# EAGLE schematic maximus (EAGLE 9.6.2)
Assembly variants: basic

## Sheet 1 of 3: Input connector, power
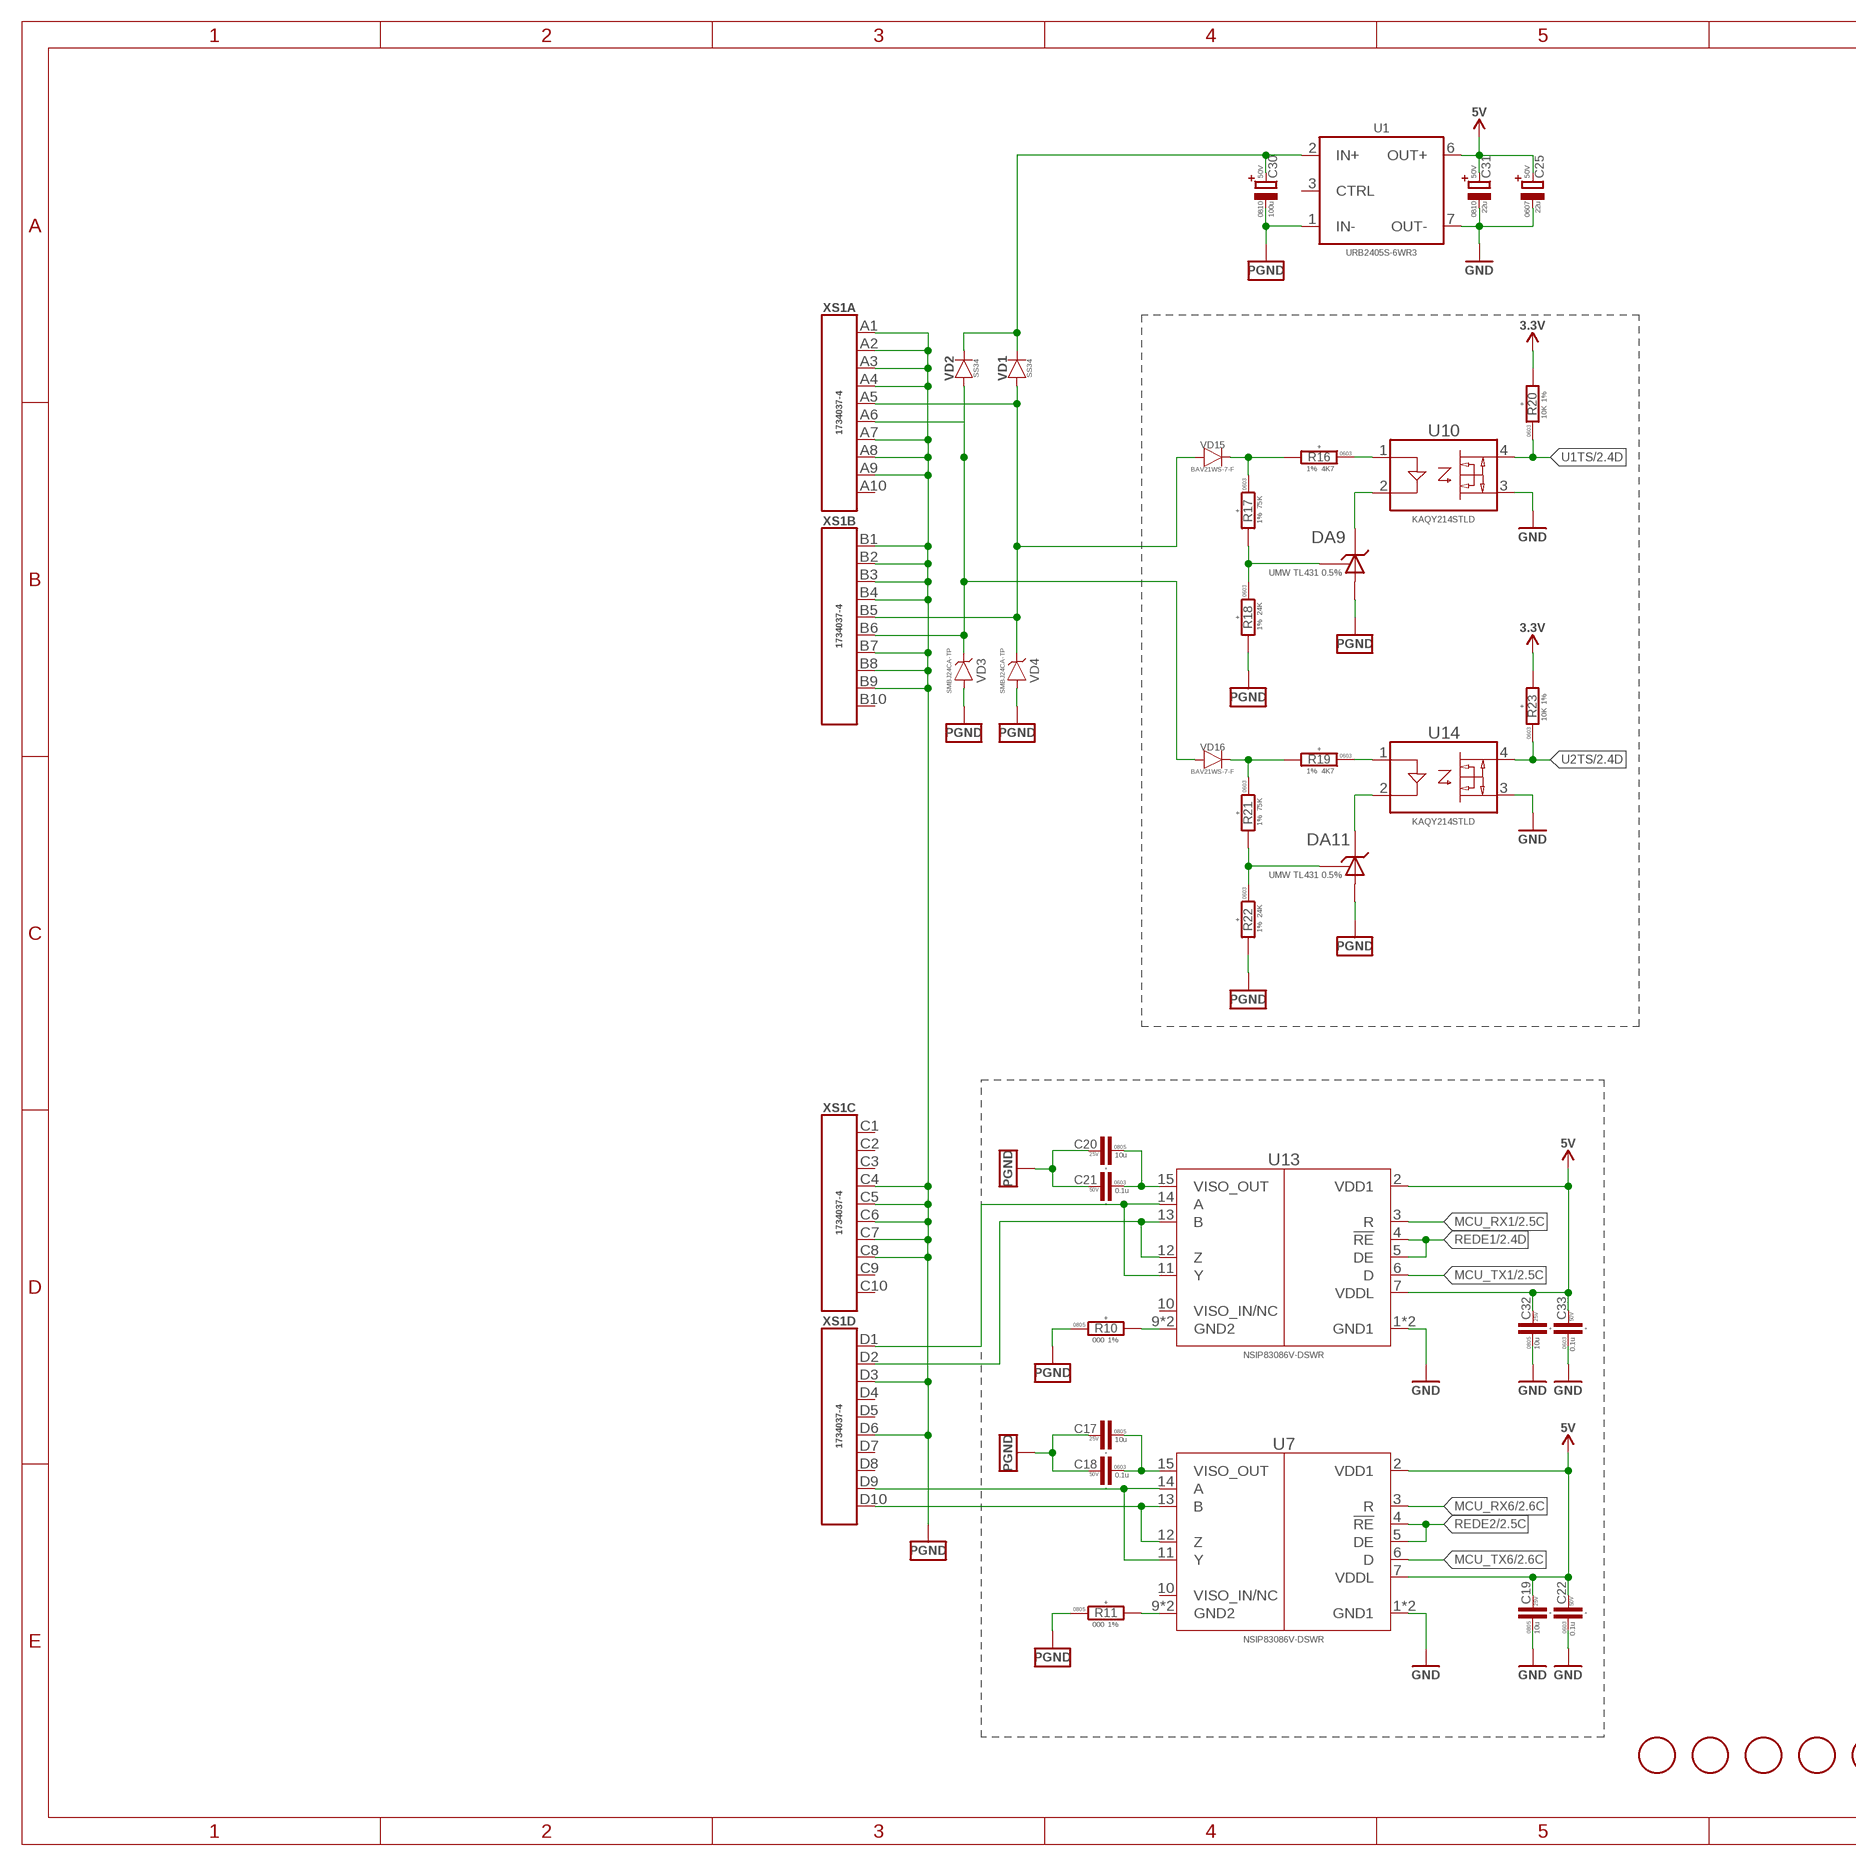
[diagram p0: schematic, sheet 1, part 1 of 2]
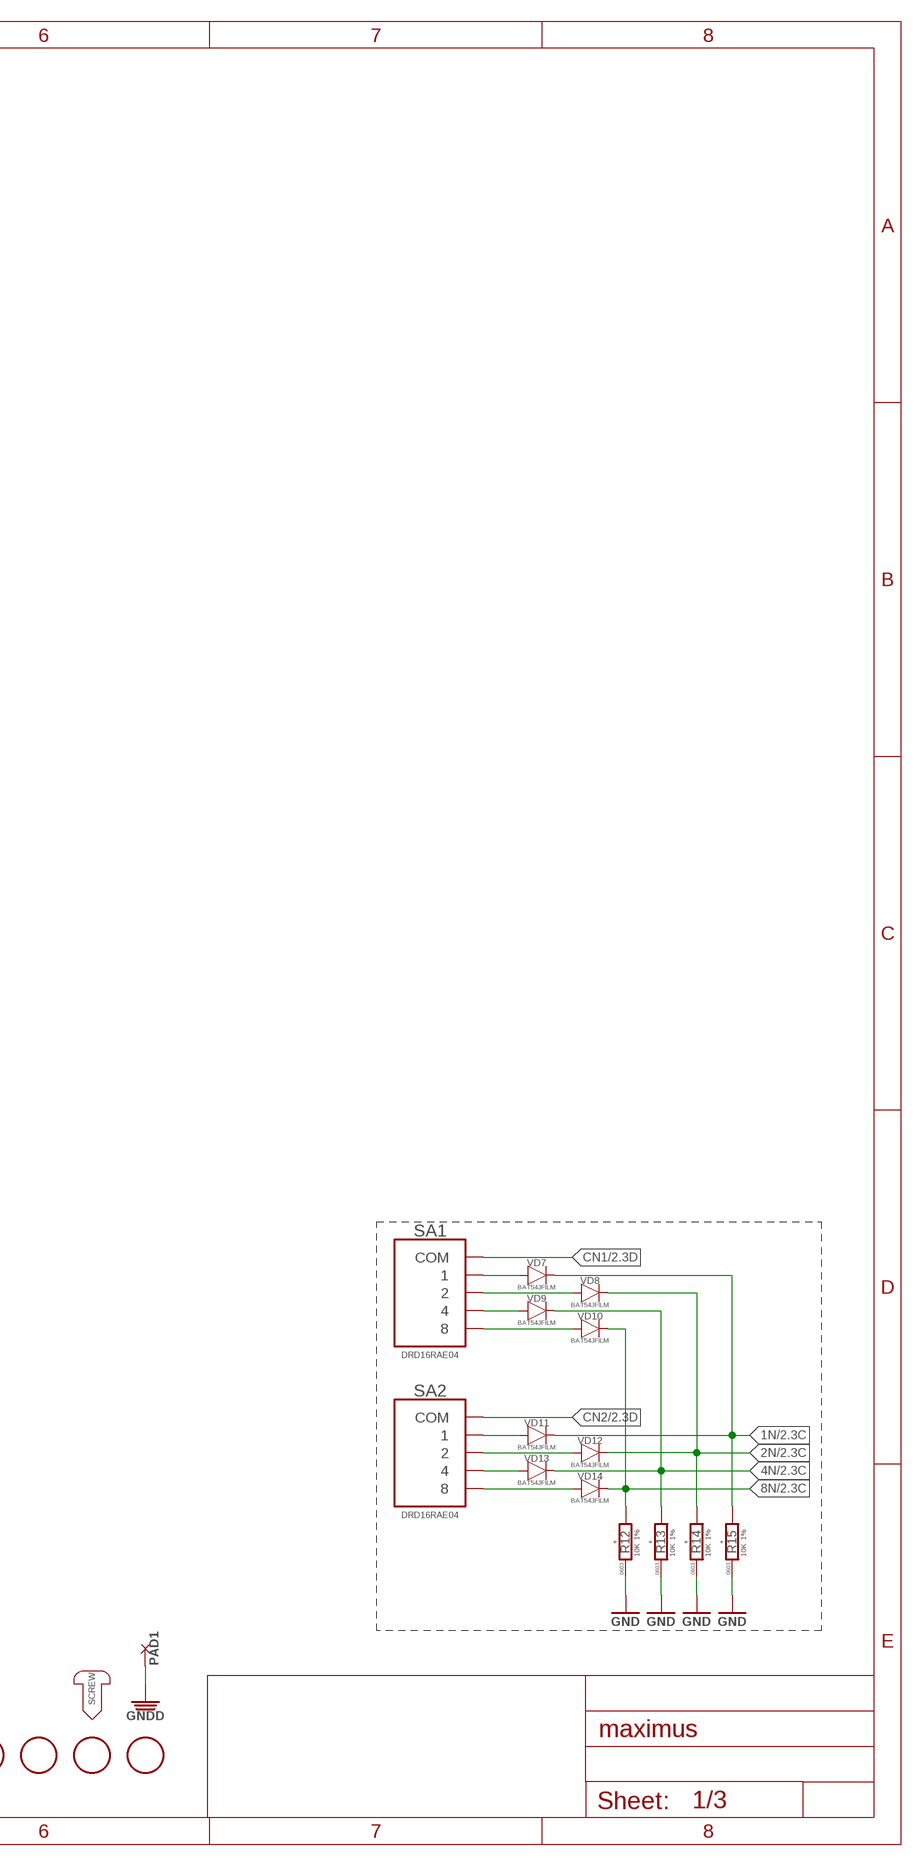
[diagram p1: schematic, sheet 1, part 2 of 2]

### Parts
C17  10u  C-0805  [C0805]
C18  0.1u  C-0603  [C0603]
C19  10u  C-0805  [C0805]
C20  10u  C-0805  [C0805]
C21  0.1u  C-0603  [C0603]
C22  0.1u  C-0603  [C0603]
C25  22u  CPOL-SMD_6.3X7.7  [CAP_SMD_6.3X7.7]
C30  100u  CPOL-SMD-8X10  [SMD-0810]
C31  22u  CPOL-SMD-8X10  [SMD-0810]  (not fitted in variant basic)
C32  10u  C-0805  [C0805]
C33  0.1u  C-0603  [C0603]
DA9  TL431  [SOT23-3]
DA11  TL431  [SOT23-3]
FD1  FIDUCIALMOUNT  [FIDUCIAL_MOUNT]  (not fitted in variant basic)
FD2  FIDUCIALMOUNT  [FIDUCIAL_MOUNT]  (not fitted in variant basic)
FD3  FIDUCIALMOUNT  [FIDUCIAL_MOUNT]  (not fitted in variant basic)
FD4  FIDUCIALMOUNT  [FIDUCIAL_MOUNT]  (not fitted in variant basic)
FD5  FIDUCIALMOUNT  [FIDUCIAL_MOUNT]  (not fitted in variant basic)
FD6  FIDUCIALMOUNT  [FIDUCIAL_MOUNT]  (not fitted in variant basic)
FD7  FIDUCIALMOUNT  [FIDUCIAL_MOUNT]  (not fitted in variant basic)
PAD1  PAD-8.3X3  [8.3X3]  (not fitted in variant basic)
R10  000  R-1%-0805  [R0805]
R11  000  R-1%-0805  [R0805]
R12  10K  R-1%-0603  [R0603]
R13  10K  R-1%-0603  [R0603]
R14  10K  R-1%-0603  [R0603]
R15  10K  R-1%-0603  [R0603]
R16  4K7  R-1%-0603  [R0603]
R17  75K  R-1%-0603  [R0603]
R18  24K  R-1%-0603  [R0603]
R19  4K7  R-1%-0603  [R0603]
R20  10K  R-1%-0603  [R0603]
R21  75K  R-1%-0603  [R0603]
R22  24K  R-1%-0603  [R0603]
R23  10K  R-1%-0603  [R0603]
SA1  DRD16RAE04  [DRD16RAE04]
SA2  DRD16RAE04  [DRD16RAE04]
SCR1  SCREW-M3-D3.1  [PCB_SCREW_M3-D3.1]  (not fitted in variant basic)
U1  URB2405S-6WR3  [URB_S-6WR3]
U7  NSIP83086(V)  [SOIC16-300MIL]
U10  KAQY214-SOP-4  [SOP-4]
U13  NSIP83086(V)  [SOIC16-300MIL]
U14  KAQY214-SOP-4  [SOP-4]
VD1  SS34  [DO-214AC(SMA)]
VD2  SS34  [DO-214AC(SMA)]
VD3  SMBJ24CA-SMB  [DO-214AA(SMB)]
VD4  SMBJ24CA-SMB  [DO-214AA(SMB)]
VD7  BAT54JFILM  [SOD323]
VD8  BAT54JFILM  [SOD323]
VD9  BAT54JFILM  [SOD323]
VD10  BAT54JFILM  [SOD323]
VD11  BAT54JFILM  [SOD323]
VD12  BAT54JFILM  [SOD323]
VD13  BAT54JFILM  [SOD323]
VD14  BAT54JFILM  [SOD323]
VD15  BAV21WS  [SOD323]
VD16  BAV21WS  [SOD323]
XS1  1734037-4  [1734037-4]

### Nets
1N: R15.2 VD7.C VD11.C ; also sheet 2
2N: R14.2 VD8.C VD12.C ; also sheet 2
4N: R13.2 VD9.C VD13.C ; also sheet 2
8N: R12.2 VD10.C VD14.C ; also sheet 2
CN1: SA1.C_1(COM) SA1.C_2(COM) ; also sheet 2
CN2: SA2.C_1(COM) SA2.C_2(COM) ; also sheet 2
GND: C19.1 C22.1 C25.- C31.- C32.1 C33.1 R12.1 R13.1 R14.1 R15.1 U1.7(OUT-) U7.1(GND1) U7.8(GND1) U10.3(EMITTER) U13.1(GND1) U13.8(GND1) U14.3(EMITTER) ; also sheet 2,3
GNDD: PAD1.P$1 ; also sheet 3
ISO24V: C30.+ U1.2(IN+) VD1.C VD2.C
MCU_RX1: U13.3(R) ; also sheet 2
MCU_RX6: U7.3(R) ; also sheet 2
MCU_TX1: U13.6(D) ; also sheet 2
MCU_TX6: U7.6(D) ; also sheet 2
N$17: DA9.2(C) U10.2(C)
N$18: DA9.1(R) R17.2 R18.1
N$19: R16.1 U10.1(A)
N$20: R16.2 R17.1 VD15.C
N$22: DA11.2(C) U14.2(C)
N$23: DA11.1(R) R21.2 R22.1
N$24: R19.1 U14.1(A)
N$25: R19.2 R21.1 VD16.C
N$43: R11.2 U7.9(GND2) U7.16(GND2)
N$46: C20.1 C21.1 U13.15(VISO_OUT)
N$48: VD1.A VD4.C VD15.A XS1.A5 XS1.B5
N$49: VD2.A VD3.C VD16.A XS1.A6 XS1.B6
N$51: U7.11(Y) U7.14(A) XS1.D9
N$53: U7.12(Z) U7.13(B) XS1.D10
N$69: R10.2 U13.9(GND2) U13.16(GND2)
N$74: U13.11(Y) U13.14(A) XS1.D1
N$75: U13.12(Z) U13.13(B) XS1.D2
N$82: C17.1 C18.1 U7.15(VISO_OUT)
N$84: SA1.1 VD7.A
N$85: SA1.2 VD8.A
N$86: SA1.4 VD9.A
N$90: SA1.8 VD10.A
N$92: SA2.1 VD11.A
N$93: SA2.2 VD12.A
N$94: SA2.4 VD13.A
N$98: SA2.8 VD14.A
PGND: C17.2 C18.2 C20.2 C21.2 C30.- DA9.3(A) DA11.3(A) R10.1 R11.1 R18.2 R22.2 U1.1(IN-) VD3.A VD4.A XS1.A1 XS1.A2 XS1.A3 XS1.A4 XS1.A7 XS1.A8 XS1.A9 XS1.B1 XS1.B2 XS1.B3 XS1.B4 XS1.B7 XS1.B8 XS1.B9 XS1.C4 XS1.C5 XS1.C6 XS1.C7 XS1.C8 XS1.D3 XS1.D6
REDE1: U13.4(!RE) U13.5(DE) ; also sheet 2
REDE2: U7.4(!RE) U7.5(DE) ; also sheet 2
U1TS: R20.1 U10.4(COLLECTOR) ; also sheet 2
U2TS: R23.1 U14.4(COLLECTOR) ; also sheet 2
VDD_3V3: R20.2 R23.2 ; supply symbol labelled 3.3V ; also sheet 2
VDD_5V: C19.2 C22.2 C25.+ C31.+ C32.2 C33.2 U1.6(OUT+) U7.2(VDD1) U7.7(VDDL) U13.2(VDD1) U13.7(VDDL) ; supply symbol labelled 5V ; also sheet 2,3
Unconnected: U1.3(CTRL) U7.10(VISO_IN/NC) U13.10(VISO_IN/NC) XS1.A10 XS1.B10 XS1.C1 XS1.C2 XS1.C3 XS1.C9 XS1.C10 XS1.D4 XS1.D5 XS1.D7 XS1.D8

## Sheet 2 of 3: MCU
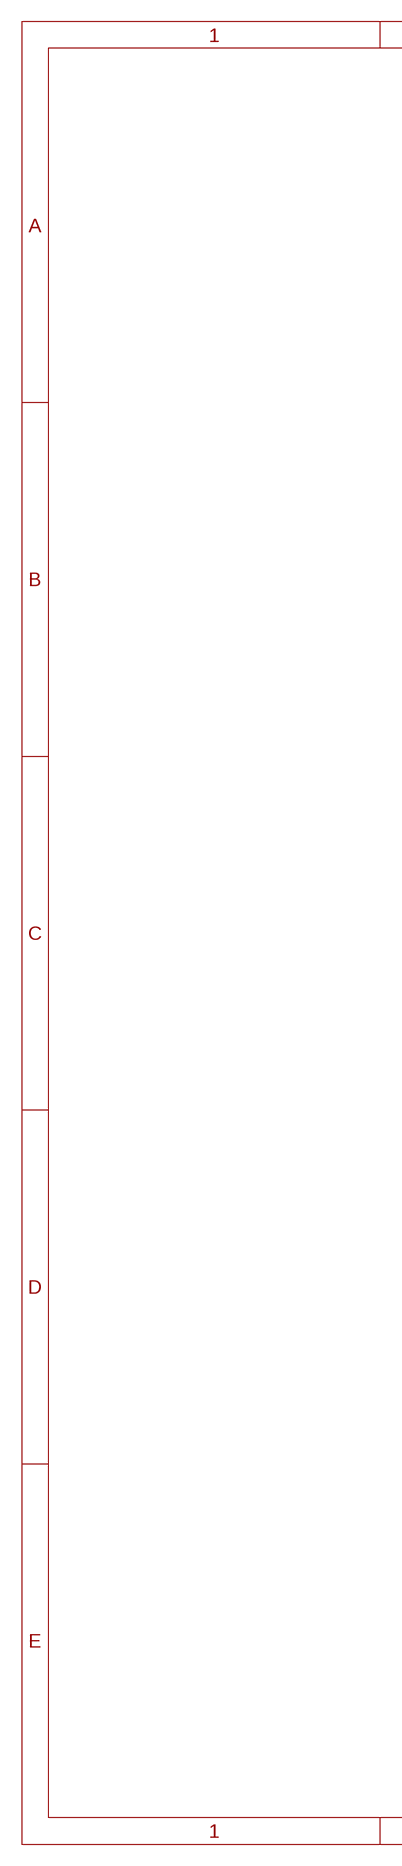
[diagram p2: schematic, sheet 2, part 1 of 2]
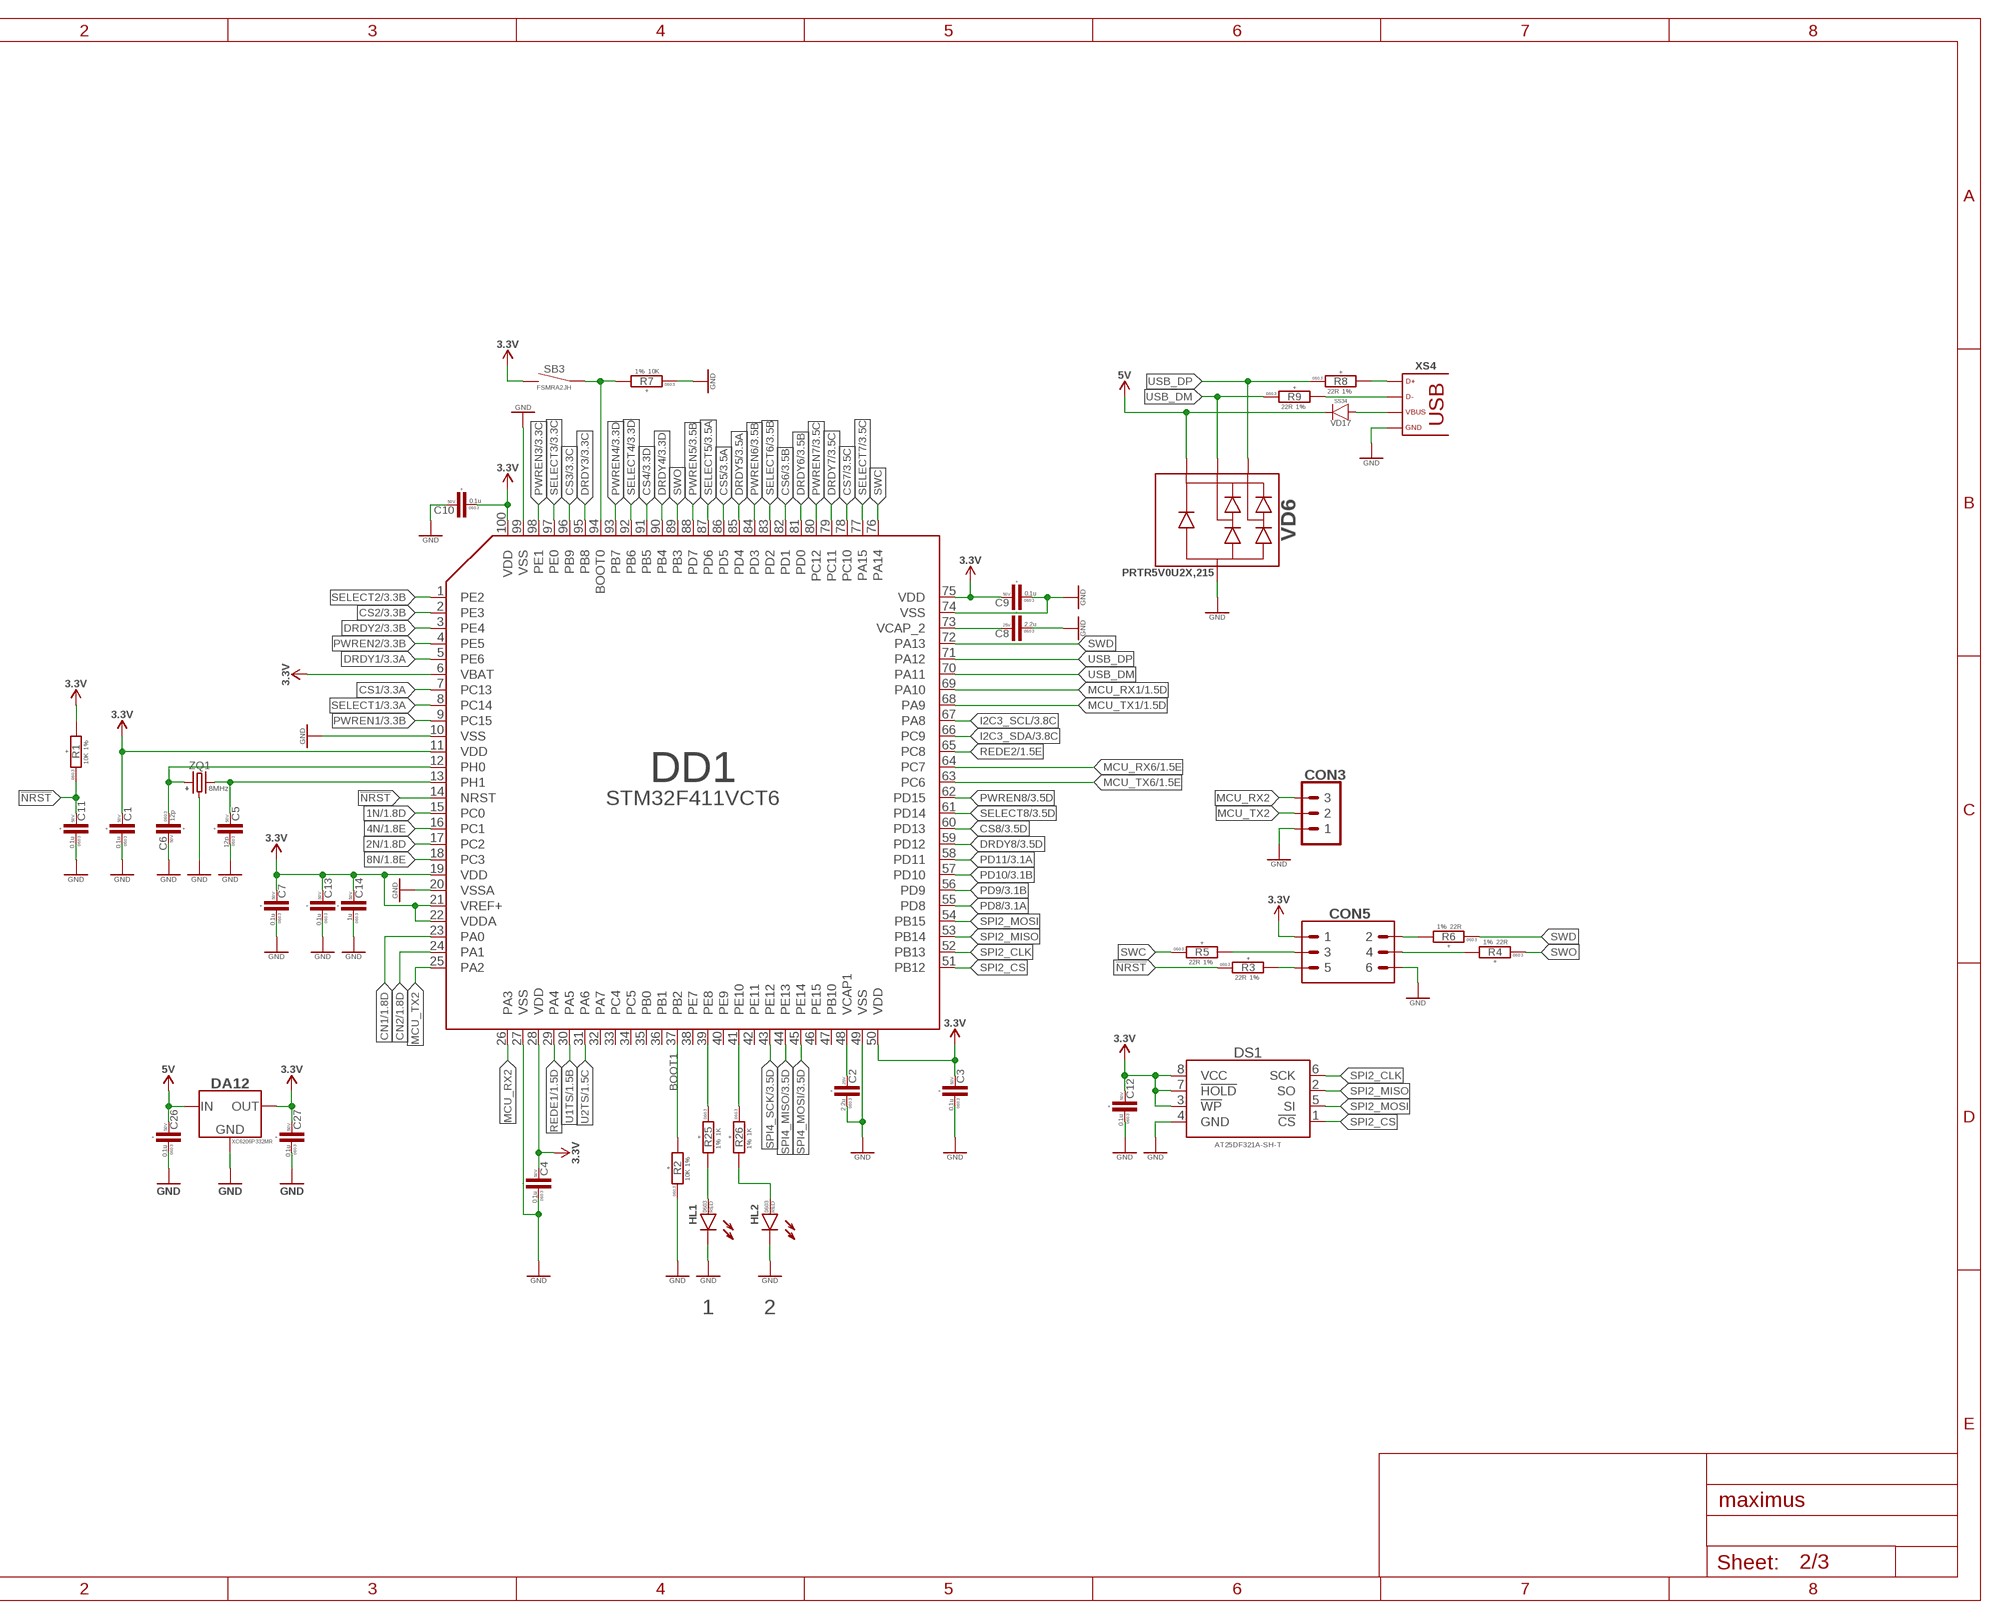
[diagram p3: schematic, sheet 2, part 2 of 2]

### Parts
C1  0.1u  C-0603  [C0603]
C2  2.2u  C-0603  [C0603]
C3  0.1u  C-0603  [C0603]
C4  0.1u  C-0603  [C0603]
C5  12p  C-0603  [C0603]
C6  12p  C-0603  [C0603]
C7  0.1u  C-0603  [C0603]
C8  2.2u  C-0603  [C0603]
C9  0.1u  C-0603  [C0603]
C10  0.1u  C-0603  [C0603]
C11  0.1u  C-0603  [C0603]
C12  0.1u  C-0603  [C0603]
C13  0.1u  C-0603  [C0603]
C14  1u  C-0603  [C0603]
C26  0.1u  C-0603  [C0603]
C27  0.1u  C-0603  [C0603]
CON3  PINHEAD_1X03-2.54  [PLS3]  (not fitted in variant basic)
CON5  PINHEAD_2X03-PTH-2.54  [PLD6]  (not fitted in variant basic)
DA12  XC6206P332  [SOT23-3]
DD1  STM32F411VCT6  [LQFP100]
DS1  AT25DF321A  [SOIC8-208MIL]
HL1  LED-0603  [LED0603]
HL2  LED-0603  [LED0603]
R1  10K  R-1%-0603  [R0603]
R2  10K  R-1%-0603  [R0603]
R3  22R  R-1%-0603  [R0603]
R4  22R  R-1%-0603  [R0603]
R5  22R  R-1%-0603  [R0603]
R6  22R  R-1%-0603  [R0603]
R7  10K  R-1%-0603  [R0603]
R8  22R  R-1%-0603  [R0603]
R9  22R  R-1%-0603  [R0603]
R25  1K  R-1%-0603  [R0603]
R26  1K  R-1%-0603  [R0603]
SB3  TACT_SWITCH-KLS-KLS7-TS6606  [KLS7-TS6606-5.0-180]
VD6  PRTR5V0U2X  [SOT143B]
VD17  SS34  [DO-214AC(SMA)]
XS4  USB-TYPE-B  [USB-B]
ZQ1  8MHz  CRYSTAL-4P-3.2X2.5  [OSCILLATOR-3.2X2.5-4P]

### Nets
1N: DD1.15(PC0) ; also sheet 1
2N: DD1.17(PC2) ; also sheet 1
4N: DD1.16(PC1) ; also sheet 1
8N: DD1.18(PC3) ; also sheet 1
!NRST: C11.2 DD1.14(NRST) R1.1 R3.1
BOOT0: DD1.94(BOOT0) R7.2 SB3.1
BOOT1: DD1.37(PB2) R2.2
CN1: DD1.23(PA0) ; also sheet 1
CN2: DD1.24(PA1) ; also sheet 1
CS1: DD1.7(PC13) ; also sheet 3
CS2: DD1.2(PE3) ; also sheet 3
CS3: DD1.96(PB9) ; also sheet 3
CS4: DD1.91(PB5) ; also sheet 3
CS5: DD1.86(PD5) ; also sheet 3
CS6: DD1.82(PD1) ; also sheet 3
CS7: DD1.78(PC10) ; also sheet 3
CS8: DD1.60(PD13) ; also sheet 3
DRDY1: DD1.5(PE6) ; also sheet 3
DRDY2: DD1.3(PE4) ; also sheet 3
DRDY3: DD1.95(PB8) ; also sheet 3
DRDY4: DD1.90(PB4) ; also sheet 3
DRDY5: DD1.85(PD4) ; also sheet 3
DRDY6: DD1.81(PD0) ; also sheet 3
DRDY7: DD1.79(PC11) ; also sheet 3
DRDY8: DD1.59(PD12) ; also sheet 3
GND: C1.1 C2.1 C3.1 C4.1 C5.1 C6.2 C7.1 C8.1 C9.1 C10.2 C11.1 C12.1 C13.1 C14.1 C26.1 C27.1 CON3.1 CON5.6 DA12.1(GND) DD1.10(VSS) DD1.20(VSSA) DD1.27(VSS) DD1.49(VSS) DD1.74(VSS) DD1.99(VSS) DS1.4(GND) HL1.C HL2.C R2.1 R7.1 VD6.1(C) XS4.4(GND) XS4.5_1(GND) XS4.5_2(GND) ZQ1.2(GND) ZQ1.4(GND) ; also sheet 1,3
I2C3_SCL: DD1.67(PA8) ; also sheet 3
I2C3_SDA: DD1.66(PC9) ; also sheet 3
MCU_RX1: DD1.69(PA10) ; also sheet 1
MCU_RX2: CON3.3 DD1.26(PA3)
MCU_RX6: DD1.64(PC7) ; also sheet 1
MCU_TX1: DD1.68(PA9) ; also sheet 1
MCU_TX2: CON3.2 DD1.25(PA2)
MCU_TX6: DD1.63(PC6) ; also sheet 1
N$1: C2.2 DD1.48(VCAP1)
N$2: C8.2 DD1.73(VCAP_2)
N$3: CON5.5 R3.2
N$4: C6.1 DD1.12(PH0) ZQ1.1
N$5: C5.2 DD1.13(PH1) ZQ1.3
N$6: CON5.4 R4.2
N$7: CON5.3 R5.2
N$8: CON5.2 R6.2
N$21: HL1.A R25.2
N$26: HL2.A R26.2
N$27: DD1.39(PE8) R25.1
N$37: DD1.41(PE10) R26.1
N$70: R9.2 XS4.2(D-)
N$71: R8.2 XS4.3(D+)
N$72: VD17.A XS4.1(VBUS)
PD8: DD1.55(PD8) ; also sheet 3
PD9: DD1.56(PD9) ; also sheet 3
PD10: DD1.57(PD10) ; also sheet 3
PD11: DD1.58(PD11) ; also sheet 3
PWREN1: DD1.9(PC15) ; also sheet 3
PWREN2: DD1.4(PE5) ; also sheet 3
PWREN3: DD1.98(PE1) ; also sheet 3
PWREN4: DD1.93(PB7) ; also sheet 3
PWREN5: DD1.88(PD7) ; also sheet 3
PWREN6: DD1.84(PD3) ; also sheet 3
PWREN7: DD1.80(PC12) ; also sheet 3
PWREN8: DD1.62(PD15) ; also sheet 3
REDE1: DD1.29(PA4) ; also sheet 1
REDE2: DD1.65(PC8) ; also sheet 1
SELECT1: DD1.8(PC14) ; also sheet 3
SELECT2: DD1.1(PE2) ; also sheet 3
SELECT3: DD1.97(PE0) ; also sheet 3
SELECT4: DD1.92(PB6) ; also sheet 3
SELECT5: DD1.87(PD6) ; also sheet 3
SELECT6: DD1.83(PD2) ; also sheet 3
SELECT7: DD1.77(PA15) ; also sheet 3
SELECT8: DD1.61(PD14) ; also sheet 3
SPI2_CLK: DD1.52(PB13) DS1.6(SCK)
SPI2_CS: DD1.51(PB12) DS1.1(!CS)
SPI2_MISO: DD1.53(PB14) DS1.2(SO)
SPI2_MOSI: DD1.54(PB15) DS1.5(SI)
SPI4_MISO: DD1.44(PE13) ; also sheet 3
SPI4_MOSI: DD1.45(PE14) ; also sheet 3
SPI4_SCK: DD1.43(PE12) ; also sheet 3
SWC: DD1.76(PA14) R5.1
SWD: DD1.72(PA13) R6.1
SWO: DD1.89(PB3) R4.1
U1TS: DD1.30(PA5) ; also sheet 1
U2TS: DD1.31(PA6) ; also sheet 1
USB_DM: DD1.70(PA11) R9.1 VD6.3(D2)
USB_DP: DD1.71(PA12) R8.1 VD6.2(D1)
VDD_3V3: C1.2 C3.2 C4.2 C7.2 C9.2 C10.1 C12.2 C13.2 C14.2 C27.2 CON5.1 DA12.2(OUT) DD1.6(VBAT) DD1.11(VDD) DD1.19(VDD) DD1.21(VREF+) DD1.22(VDDA) DD1.28(VDD) DD1.50(VDD) DD1.75(VDD) DD1.100(VDD) DS1.3(!WP) DS1.7(!HOLD) DS1.8(VCC) R1.2 SB3.2 ; supply symbol labelled 3.3V ; also sheet 1
VDD_5V: C26.2 DA12.3(IN) VD6.4(A) VD17.C ; supply symbol labelled 5V ; also sheet 1,3
Unconnected: DD1.32(PA7) DD1.33(PC4) DD1.34(PC5) DD1.35(PB0) DD1.36(PB1) DD1.38(PE7) DD1.40(PE9) DD1.42(PE11) DD1.46(PE15) DD1.47(PB10)

### Notes on the sheet
- 1 | 2

## Sheet 3 of 3: Measuring part and main connector
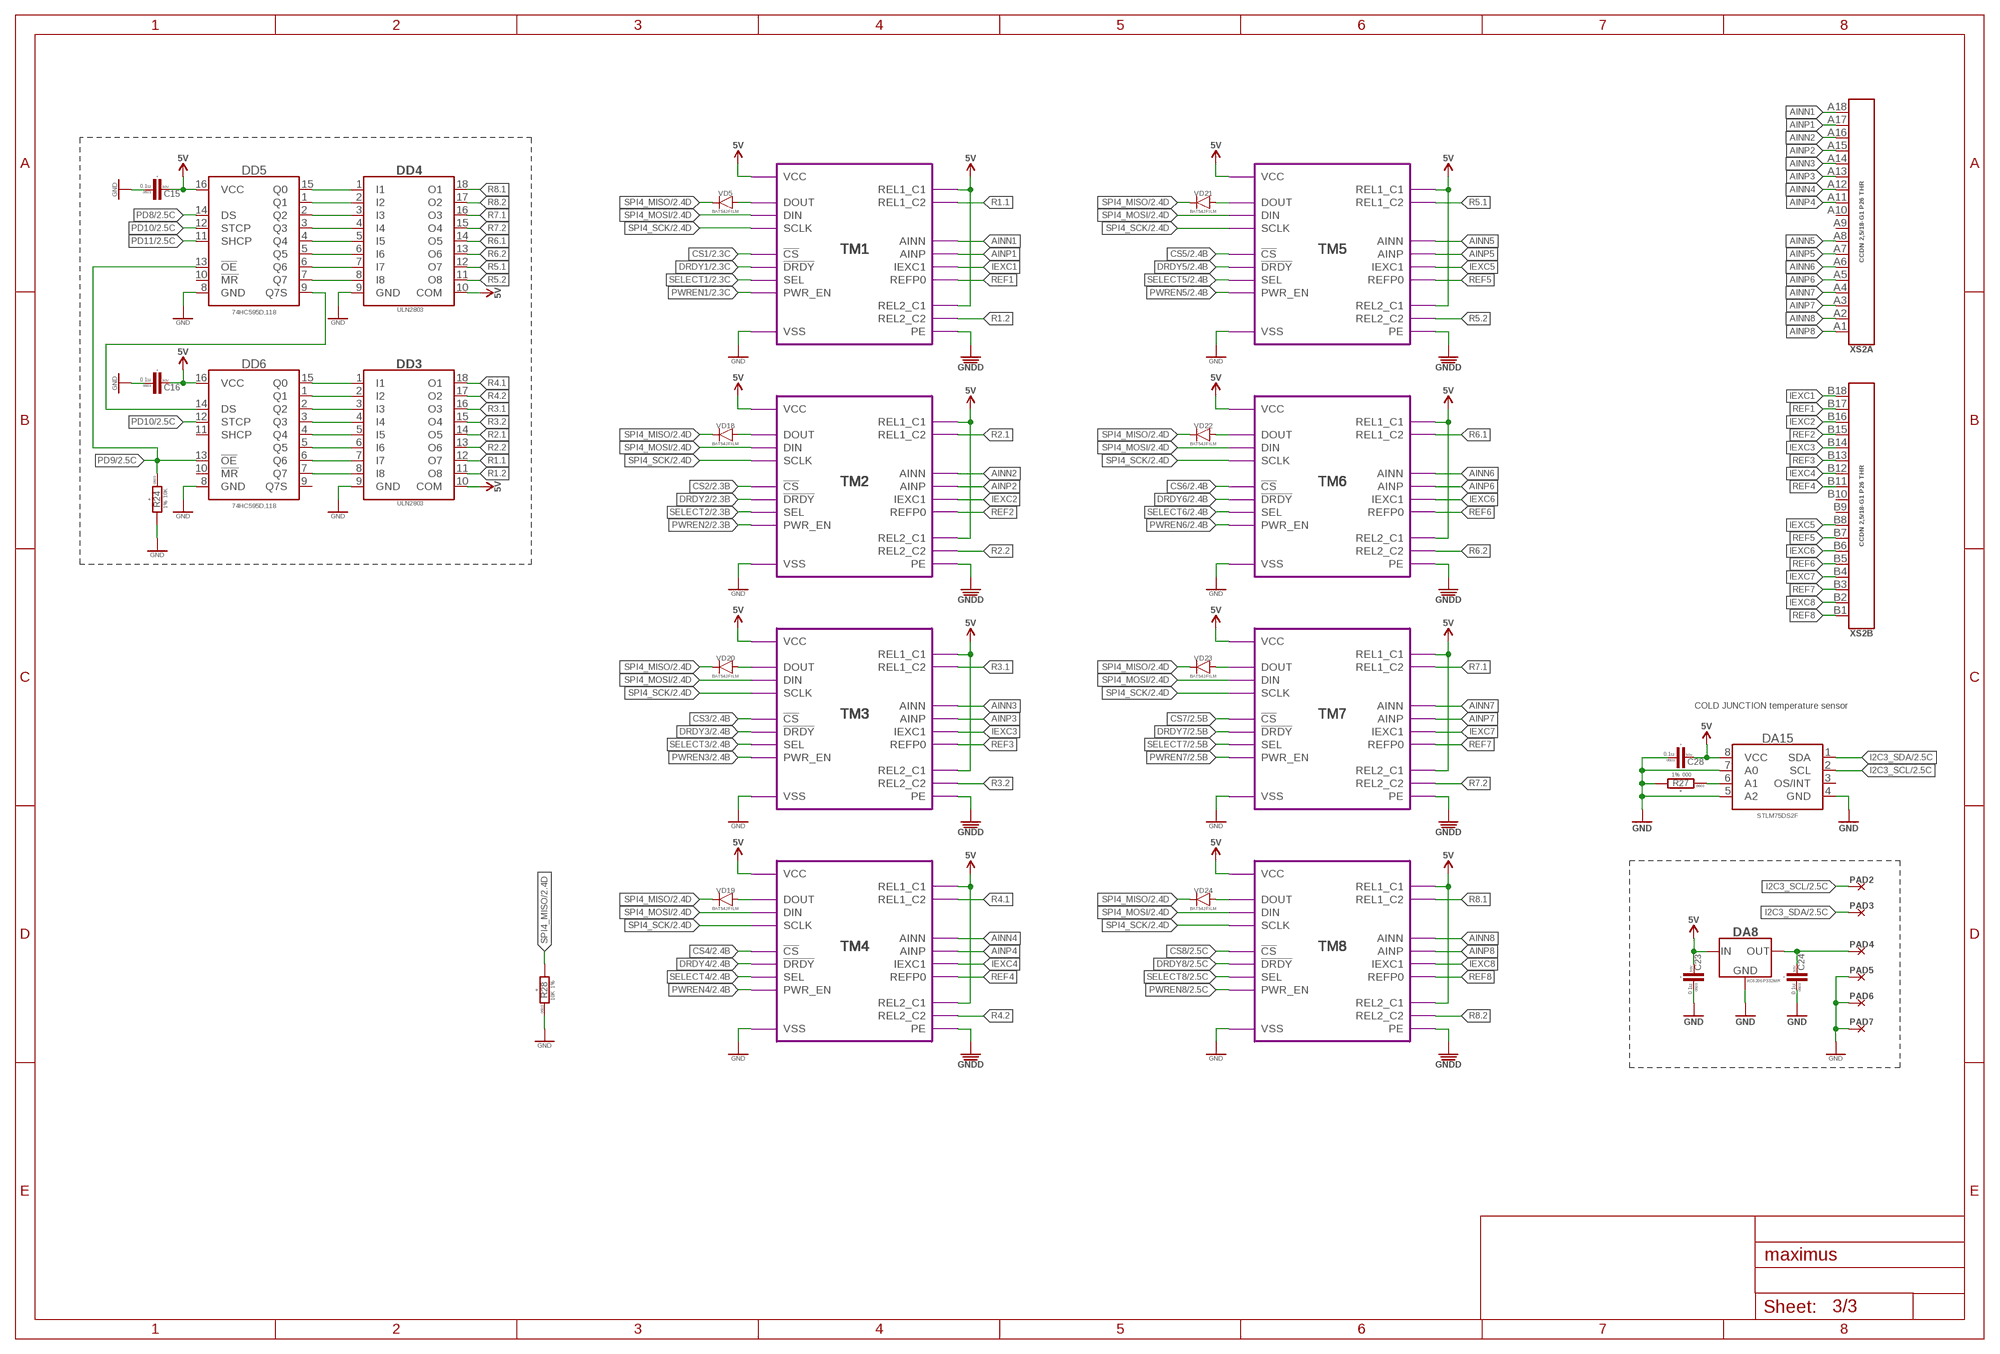
[diagram p4: schematic, sheet 3]

### Parts
C15  0.1u  C-0603  [C0603]
C16  0.1u  C-0603  [C0603]
C23  0.1u  C-0603  [C0603]
C24  0.1u  C-0603  [C0603]
C28  0.1u  C-0603  [C0603]
DA8  XC6206P332  [SOT23-3]
DA15  STLM75  [MSOP8]
DD3  ULN2803  [SOIC18-300MIL]
DD4  ULN2803  [SOIC18-300MIL]
DD5  74HC595  [SOIC16]
DD6  74HC595  [SOIC16]
PAD2  PAD-5X3  [5X3]  (not fitted in variant basic)
PAD3  PAD-5X3  [5X3]  (not fitted in variant basic)
PAD4  PAD-5X3  [5X3]  (not fitted in variant basic)
PAD5  PAD-5X3  [5X3]  (not fitted in variant basic)
PAD6  PAD-5X3  [5X3]  (not fitted in variant basic)
PAD7  PAD-5X3  [5X3]  (not fitted in variant basic)
R24  10K  R-1%-0603  [R0603]
R27  000  R-1%-0603  [R0603]
R28  10K  R-1%-0603  [R0603]
VD5  BAT54JFILM  [SOD323]
VD18  BAT54JFILM  [SOD323]
VD19  BAT54JFILM  [SOD323]
VD20  BAT54JFILM  [SOD323]
VD21  BAT54JFILM  [SOD323]
VD22  BAT54JFILM  [SOD323]
VD23  BAT54JFILM  [SOD323]
VD24  BAT54JFILM  [SOD323]
XS2  CCDN2,5/18-G1P26THR  [CCDN2.5_18-G1P26THR]

### Module instances
TM1 = TMETER (part numbers offset by 100)
TM2 = TMETER (part numbers offset by 200)
TM3 = TMETER (part numbers offset by 300)
TM4 = TMETER (part numbers offset by 400)
TM5 = TMETER (part numbers offset by 500)
TM6 = TMETER (part numbers offset by 600)
TM7 = TMETER (part numbers offset by 700)
TM8 = TMETER (part numbers offset by 800)

### Nets
AINN1: XS2.A18 ; port TM1.AINN
AINN2: XS2.A16 ; port TM2.AINN
AINN3: XS2.A14 ; port TM3.AINN
AINN4: XS2.A12 ; port TM4.AINN
AINN5: XS2.A8 ; port TM5.AINN
AINN6: XS2.A6 ; port TM6.AINN
AINN7: XS2.A4 ; port TM7.AINN
AINN8: XS2.A2 ; port TM8.AINN
AINP1: XS2.A17 ; port TM1.AINP
AINP2: XS2.A15 ; port TM2.AINP
AINP3: XS2.A13 ; port TM3.AINP
AINP4: XS2.A11 ; port TM4.AINP
AINP5: XS2.A7 ; port TM5.AINP
AINP6: XS2.A5 ; port TM6.AINP
AINP7: XS2.A3 ; port TM7.AINP
AINP8: XS2.A1 ; port TM8.AINP
CS1: port TM1.!CS ; also sheet 2
CS2: port TM2.!CS ; also sheet 2
CS3: port TM3.!CS ; also sheet 2
CS4: port TM4.!CS ; also sheet 2
CS5: port TM5.!CS ; also sheet 2
CS6: port TM6.!CS ; also sheet 2
CS7: port TM7.!CS ; also sheet 2
CS8: port TM8.!CS ; also sheet 2
DRDY1: port TM1.!DRDY ; also sheet 2
DRDY2: port TM2.!DRDY ; also sheet 2
DRDY3: port TM3.!DRDY ; also sheet 2
DRDY4: port TM4.!DRDY ; also sheet 2
DRDY5: port TM5.!DRDY ; also sheet 2
DRDY6: port TM6.!DRDY ; also sheet 2
DRDY7: port TM7.!DRDY ; also sheet 2
DRDY8: port TM8.!DRDY ; also sheet 2
GND: C15.1 C16.1 C23.1 C24.1 C28.1 DA8.1(GND) DA15.4(GND) DA15.5(A2) DA15.7(A0) DD3.9(GND) DD4.9(GND) DD5.8(GND) DD6.8(GND) PAD5.P$1 PAD6.P$1 PAD7.P$1 R24.2 R27.2 R28.1 ; port TM1.VSS TM2.VSS TM3.VSS TM4.VSS TM5.VSS TM6.VSS TM7.VSS TM8.VSS ; also sheet 1,2
GNDD: port TM1.PE TM2.PE TM3.PE TM4.PE TM5.PE TM6.PE TM7.PE TM8.PE ; also sheet 1
I2C3_SCL: DA15.2(SCL) PAD2.P$1 ; also sheet 2
I2C3_SDA: DA15.1(SDA) PAD3.P$1 ; also sheet 2
IEXC1: XS2.B18 ; port TM1.IEXC1
IEXC2: XS2.B16 ; port TM2.IEXC1
IEXC3: XS2.B14 ; port TM3.IEXC1
IEXC4: XS2.B12 ; port TM4.IEXC1
IEXC5: XS2.B8 ; port TM5.IEXC1
IEXC6: XS2.B6 ; port TM6.IEXC1
IEXC7: XS2.B4 ; port TM7.IEXC1
IEXC8: XS2.B2 ; port TM8.IEXC1
N$9: DD4.2(I2) DD5.1(Q1)
N$10: DD4.3(I3) DD5.2(Q2)
N$11: DD4.4(I4) DD5.3(Q3)
N$12: DD4.5(I5) DD5.4(Q4)
N$13: DD4.6(I6) DD5.5(Q5)
N$14: DD4.7(I7) DD5.6(Q6)
N$15: DD4.8(I8) DD5.7(Q7)
N$16: DD4.1(I1) DD5.15(Q0)
N$28: DD3.2(I2) DD6.1(Q1)
N$29: DD3.3(I3) DD6.2(Q2)
N$30: DD3.4(I4) DD6.3(Q3)
N$31: DD3.5(I5) DD6.4(Q4)
N$32: DD3.6(I6) DD6.5(Q5)
N$33: DD3.7(I7) DD6.6(Q6)
N$34: DD3.8(I8) DD6.7(Q7)
N$35: DD3.1(I1) DD6.15(Q0)
N$36: DD5.9(Q7S) DD6.14(DS)
N$38: DA15.6(A1) R27.1
N$39: VD5.A ; port TM1.DOUT
N$40: VD18.A ; port TM2.DOUT
N$41: VD19.A ; port TM4.DOUT
N$42: VD20.A ; port TM3.DOUT
N$44: VD21.A ; port TM5.DOUT
N$45: VD22.A ; port TM6.DOUT
N$47: C24.2 DA8.2(OUT) PAD4.P$1
N$50: VD23.A ; port TM7.DOUT
N$52: VD24.A ; port TM8.DOUT
PD8: DD5.14(DS) ; also sheet 2
PD9: DD5.13(!OE) DD6.13(!OE) R24.1 ; also sheet 2
PD10: DD5.12(STCP) DD6.12(STCP) ; also sheet 2
PD11: DD5.11(SHCP) ; also sheet 2
PWREN1: port TM1.PWR_EN ; also sheet 2
PWREN2: port TM2.PWR_EN ; also sheet 2
PWREN3: port TM3.PWR_EN ; also sheet 2
PWREN4: port TM4.PWR_EN ; also sheet 2
PWREN5: port TM5.PWR_EN ; also sheet 2
PWREN6: port TM6.PWR_EN ; also sheet 2
PWREN7: port TM7.PWR_EN ; also sheet 2
PWREN8: port TM8.PWR_EN ; also sheet 2
R1.1: DD3.12(O7) ; port TM1.REL1_C2
R1.2: DD3.11(O8) ; port TM1.REL2_C2
R2.1: DD3.14(O5) ; port TM2.REL1_C2
R2.2: DD3.13(O6) ; port TM2.REL2_C2
R3.1: DD3.16(O3) ; port TM3.REL1_C2
R3.2: DD3.15(O4) ; port TM3.REL2_C2
R4.1: DD3.18(O1) ; port TM4.REL1_C2
R4.2: DD3.17(O2) ; port TM4.REL2_C2
R5.1: DD4.12(O7) ; port TM5.REL1_C2
R5.2: DD4.11(O8) ; port TM5.REL2_C2
R6.1: DD4.14(O5) ; port TM6.REL1_C2
R6.2: DD4.13(O6) ; port TM6.REL2_C2
R7.1: DD4.16(O3) ; port TM7.REL1_C2
R7.2: DD4.15(O4) ; port TM7.REL2_C2
R8.1: DD4.18(O1) ; port TM8.REL1_C2
R8.2: DD4.17(O2) ; port TM8.REL2_C2
REF1: XS2.B17 ; port TM1.REFP0
REF2: XS2.B15 ; port TM2.REFP0
REF3: XS2.B13 ; port TM3.REFP0
REF4: XS2.B11 ; port TM4.REFP0
REF5: XS2.B7 ; port TM5.REFP0
REF6: XS2.B5 ; port TM6.REFP0
REF7: XS2.B3 ; port TM7.REFP0
REF8: XS2.B1 ; port TM8.REFP0
SELECT1: port TM1.SEL ; also sheet 2
SELECT2: port TM2.SEL ; also sheet 2
SELECT3: port TM3.SEL ; also sheet 2
SELECT4: port TM4.SEL ; also sheet 2
SELECT5: port TM5.SEL ; also sheet 2
SELECT6: port TM6.SEL ; also sheet 2
SELECT7: port TM7.SEL ; also sheet 2
SELECT8: port TM8.SEL ; also sheet 2
SPI4_MISO: R28.2 VD5.C VD18.C VD19.C VD20.C VD21.C VD22.C VD23.C VD24.C ; also sheet 2
SPI4_MOSI: port TM1.DIN TM2.DIN TM3.DIN TM4.DIN TM5.DIN TM6.DIN TM7.DIN TM8.DIN ; also sheet 2
SPI4_SCK: port TM1.SCLK TM2.SCLK TM3.SCLK TM4.SCLK TM5.SCLK TM6.SCLK TM7.SCLK TM8.SCLK ; also sheet 2
VDD_5V: C15.2 C16.2 C23.2 C28.2 DA8.3(IN) DA15.8(VCC) DD3.10(COM) DD4.10(COM) DD5.16(VCC) DD6.16(VCC) ; port TM1.VCC TM2.VCC TM3.VCC TM4.VCC TM5.VCC TM6.VCC TM7.VCC TM8.VCC TM1.REL2_C1 TM1.REL1_C1 TM2.REL2_C1 TM2.REL1_C1 TM3.REL2_C1 TM3.REL1_C1 TM4.REL2_C1 TM4.REL1_C1 TM5.REL2_C1 TM5.REL1_C1 TM6.REL2_C1 TM6.REL1_C1 TM7.REL2_C1 TM7.REL1_C1 TM8.REL2_C1 TM8.REL1_C1 ; supply symbol labelled 5V ; also sheet 1,2
Unconnected: DA15.3(OS/INT) DD5.10(!MR) DD6.9(Q7S) DD6.10(!MR) DD6.11(SHCP) XS2.A9 XS2.A10 XS2.B9 XS2.B10

### Notes on the sheet
- COLD JUNCTION temperature sensor

## Library data of the parts
C1 C3 C4 C7 C9-C13 C15 C16 C18 C21-C24 C26-C28 C33 = rc:C; ALLOCATED: +; LCSC#: C91183; MANF: YAGEO; MANF#: CC0603JRX7R9BB104; PACKAGE: 0603; RU: Конденсатор керамический SMD 0603; VOLTAGE: 50V
C2 C8 = rc:C; ALLOCATED: +; LCSC#: C77047; MANF: muRata; MANF#: GRM188R61E225KA12D; PACKAGE: 0603; RU: Конденсатор керамический SMD 0603; VOLTAGE: 25V
C5 C6 = rc:C; ALLOCATED: +; LCSC#: C107034; MANF: YAGEO; MANF#: CC0603JRNPO9BN120; PACKAGE: 0603; RU: Конденсатор керамический SMD 0603; VOLTAGE: 50V
C14 = rc:C; ALLOCATED: +; LCSC#: C559769; MANF: YAGEO; MANF#: CC0603KRX7R9BB105; PACKAGE: 0603; RU: Конденсатор керамический SMD 0603; VOLTAGE: 50V
C17 C19 C20 C32 = rc:C; ALLOCATED: +; LCSC#: C89831; MANF: YAGEO; MANF#: CC0805KKX5R8BB106; PACKAGE: 0805; RU: Конденсатор керамический SMD 0805; VOLTAGE: 25V
C25 = rc:CPOL: Polar electrolytic or tantalum capacitor; LCSC#: C72505; MANF: RVT1H220M0605; MANF#: ROQANG; PACKAGE: 0607; RU: Конденсатор; VOLTAGE: 50V
C30 = rc:CPOL: Polar electrolytic or tantalum capacitor; LCSC#: C116241; MANF: Nichicon; MANF#: UUD1H101MNL1GS; PACKAGE: 0810; RU: Конденсатор; VOLTAGE: 50V
C31 = rc:CPOL: Polar electrolytic or tantalum capacitor; LCSC#: C413506; MANF: PANASONIC; MANF#: EEEHD1H220P; PACKAGE: 0810; RU: Конденсатор; VOLTAGE: 50V
CON3 = pinhead:PINHEAD_1X03: pinheader 3P
CON5 = pinhead:PINHEAD_2X03; RU: Вилка штыревая 2.54мм 2x3 прямая
DA8 DA12 = linear regulators:XC6206P: 200mA 680mV@(100mA) Fixed 3.3V~3.3V Positive 1 6V SOT-23-3L Linear Voltage Regulators (LDO) ROHS; JLC_TYPE: BASIC; LCSC#: C5446; MANF: Torex Semicon; MANF#: XC6206P332MR; RU: LDO-стабилизатор напряжения, положительный, фиксированный 3,3 В, ток 200 мА
DA9 DA11 = misc:TL431: Adjustable Precision Shunt Regulator; LCSC#: C963380; MANF: Youtai Semiconductor (UMW); MANF#: UMW TL431 0.5%; RU: Прецизионный регулируемый шунтирующий стабилизатор напряжения
DA15 = misc:STLM75: Digital temperature sensor and thermal watchdog; LCSC#: C283291; MANF: STMicroelectronics; MANF#: STLM75DS2F; RU: Микросхема
DD1 = stm32:STM32F411VCT6: Arm® Cortex®-M4 32b MCU+FPU, 125 DMIPS, 512KB Flash, 128KB RAM, USB OTG FS, 11 TIMs, Datasheet <https://www.lcsc.com/datasheet/C1339312.pdf?spm=wm.sxq.inf.ggs___wm.ssy.bg.0.stp&lcsc_vid=E1QMBFMDFlVWAVZSR1MIUVQAQwBcV1AFEQJaV1wDEwcxVlNRQVJaU1VSRFFbVDsOAxUeFF5JWBYZEEoKFBINSQcJGk4%3D>; LCSC#: C1339312; MANF: STMicroelectronics; MANF#: STM32F411VCT6; RU: Микросхема
DD3 DD4 = misc:ULN2803: SOP-18 Plastic-Encapsulate Transistors ULN2803 DARLINGTON TRANSISTOR (NPN); LCSC#: C2829421; MANF: JSCJ; MANF#: ULN2803; RU: Матрица из восьми транзисторов Дарлингтона
DD5 DD6 = misc:74HC595: IC SHIFT REGISTER 8BIT 16SOIC; DIGIKEY#: 1727-2821-2-ND; LCSC#: C5947; MANF: Nexperia USA Inc; MANF#: 74HC595D,118; RU: 8-и битный сдвиговый регистр с выходным регистром-защелки и тремя состояниями
DS1 = misc:AT25DF321A: 32-Megabit 2.7-volt Minimum SPI Serial Flash Memory Datasheet <https://static.chipdip.ru/lib/314/DOC000314047.pdf>; LCSC#: C6490; MANF: RENESAS; MANF#: AT25DF321A-SH-T; RU: Микросхема
FD1-FD7 = misc:FIDUCIALMOUNT; BOM: EXCLUDE
HL1 HL2 = rc:LED: Light emitting diode; COLOR: RED; LCSC#: C5158814; MANF: Ningbo Foryard Optoelectronics; MANF#: FYLS-0603URC; PACKAGE: 0603; RU: Светодиод SMD 0603
PAD1 = PADS:PAD
PAD2-PAD7 = PADS:PAD; BOM: EXCLUDE
R1 R2 R7 R12-R15 R20 R23 R24 R28 = rc:R; ALLOCATED: +; LCSC#: C98220; MANF: YAGEO; MANF#: RC0603FR-0710KL; PACKAGE: 0603; RU: Резистор SMD 0603; TOLERANCE: 1%
R3-R6 R8 R9 = rc:R; ALLOCATED: +; LCSC#: C108405; MANF: YAGEO; MANF#: RC0603JR-0722RL; PACKAGE: 0603; RU: Резистор SMD 0603; TOLERANCE: 1%
R10 R11 = rc:R; ALLOCATED: +; LCSC#: C100045; MANF: YAGEO; MANF#: RC0805FR-070RL; PACKAGE: 0805; RU: Резистор SMD 0805; TOLERANCE: 1%
R16 R19 = rc:R; ALLOCATED: +; LCSC#: C99782; MANF: YAGEO; MANF#: RC0603FR-074K7L; PACKAGE: 0603; RU: Резистор SMD 0603; TOLERANCE: 1%
R17 R21 = rc:R; ALLOCATED: +; LCSC#: C114636; MANF: YAGEO; MANF#: RC0603FR-0775KL; PACKAGE: 0603; RU: Резистор SMD 0603; TOLERANCE: 1%
R18 R22 = rc:R; ALLOCATED: +; LCSC#: C137760; MANF: YAGEO; MANF#: RC0603FR-0724KL; PACKAGE: 0603; RU: Резистор SMD 0603; TOLERANCE: 1%
R25 R26 = rc:R; ALLOCATED: +; LCSC#: C22548; MANF: YAGEO; MANF#: RC0603FR-071KL; PACKAGE: 0603; RU: Резистор SMD 0603; TOLERANCE: 1%
R27 = rc:R; ALLOCATED: +; LCSC#: C95177; MANF: YAGEO; MANF#: RC0603JR-070RL; PACKAGE: 0603; RU: Резистор SMD 0603; TOLERANCE: 1%
SA1 SA2 = misc:DRD16RAE04: Dip Switch Hexadecimal 16 Position Through Hole, Right Angle Rotary for Tool Actuator 0.4VA 20VAC/DC; LCSC#: C5439367; MANF: TE Connectivity; MANF#: DRD16RAE04; RU: Переключатель DRD16RAE04 угловой на плату
SB3 = mechanical:TACT_SWITCH: tact switch; LCSC#: C7543930; MANF: TE Connectivity; MANF#: FSMRA2JH; RU: Кнопка тактовая, угловая
SCR1 = mechanical:SCREW; LENGTH: 5 mm; STANDARD: ISO7380
U1 = dc-dc:URB2405S-6WR3: 6W isolated DC-DC converter wide input and regulated single output SIP package; LCSC#: URB2405S-6WR3; MANF: MORNSUN; MANF#: URB2405S-6WR3; RU: Изолированный DC-DC преобразователь мощностью 6 Вт
U7 U13 = serial_interfaces:NSIP83086(V): Signal Isolated RS-485 Transceiver with Integrated DC to DC Converter; MANF: NOVOSENSE Microelectronics; MANF#: NSIP83086V-DSWR; RU: Микросхема
U10 U14 = misc:KAQY214: Solid State SPST-NO(1 Form A) SOP-4-2.54mm; LCSC#: C113331; MANF: Cosmo; MANF#: KAQY214STLD; RU: Реле твердотельное
VD1 VD2 VD17 = Diodes:SS34: 40V 3A 550mV @ 3A SMA(DO-214AC) Schottky Barrier Diodes; LCSC#: C8678; MANF: MDD（Microdiode Electronics）; MANF#: SS34; RU: Диод Шоттки
VD3 VD4 = TVS_diodes:SMBJ24CA: TVS DIODE 24V 38.9V DO214AA; DIGIKEY#: SMBJ24CA-TPMSCT-ND; LCSC#: C908853; MANF: Micro Commercial Co; MANF#: SMBJ24CA-TP; RU: двунаправленный SMT TVS диод, 24В, 15.42А, 600Вт
VD5 VD7-VD14 VD18-VD24 = Diodes:BAT54JFILM: Small signal Schottky diode; MANF: STMicroelectronics; MANF#: BAT54JFILM; RU: Диод Шоттки, 0.3А, 40В
VD6 = TVS_diodes:PRTR5V0U2X: DIODES - ESD SOT-143; DIGIKEY#: 568-4140-2-ND; LCSC#: C12333; MANF: NXP USA Inc; MANF#: PRTR5V0U2X,215; RU: Подавители статического заряда 5.5В
VD15 VD16 = Diodes:BAV21WS: Diode Independent 200V 200mA Surface Mount SOD-323; LCSC#: C151350; MANF: DIODES BAV21WS-7-F; MANF#: BAV21WS-7-F; RU: Диод одиночный, 200 В, 200 мА, поверхностный монтаж
XS1 = Connectors:1734037-4: PCB Mount Receptacle, Right Angle, Board-to-Board, 40 Position, 1.27 mm [.05 in] Centerline, Gold Flash, Through Hole - Solder, CHAMP .050 Series I; ALT: L-KLS1-SCSI-10-40FLS; MANF: TE connectivity; MANF#: 1734037-4; RU: Pазъем на плату, выводной монтаж, 40 позиций
XS2 = Connectors:CCDN2,5/18-G1P26THR: CCDN 2,5/18-G1 P26 THR - PCB header Link <https://www.phoenixcontact.com/en-pc/products/printed-circuit-board-connector-ccdn-25-18-g1-p26-thr-1734436>; ALT: WJ2EDGRHB-THR-5.0-2*18Р (36pitch); MANF: Phoenix contact; MANF#: CCDN 2,5/18-G1 P26 THR; RU: Pазъем на плату для выводного монтажа, 36 позиций
XS4 = Connectors:USB: Connector Receptacle USB 2; LCSC#: C189733; MANF: Connfly electronic; MANF#: USBB-1J; RU: USB розетка на плату белая, тип B угловая
ZQ1 = crystal:CRYSTAL-4P: Smd Crystal; ALLOCATED: +; LCSC#: C2682775; LOAD_CAPACITANCE: 12p; MANF: YXC Crystal Oscillators; MANF#: X32258MOB4SI; RU: Кварцевый резонатор в корпусе для поверхностного монтажа 3225

## Module TMETER
Ports: !CS(in) !DRDY(out) DIN(in) DOUT(out) SCLK(in) VCC(pwr) VSS(pwr) PWR_EN(pwr) SEL(in) REL1_C1(nc) REL1_C2(nc) REL2_C1(nc) REL2_C2(nc) PE(nc) AINN(nc) AINP(nc) IEXC1(nc) REFP0(nc)
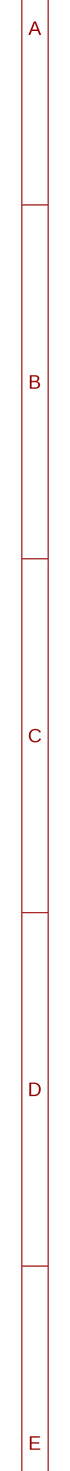
[diagram p5: schematic, module TMETER, sheet 1, part 1 of 2]
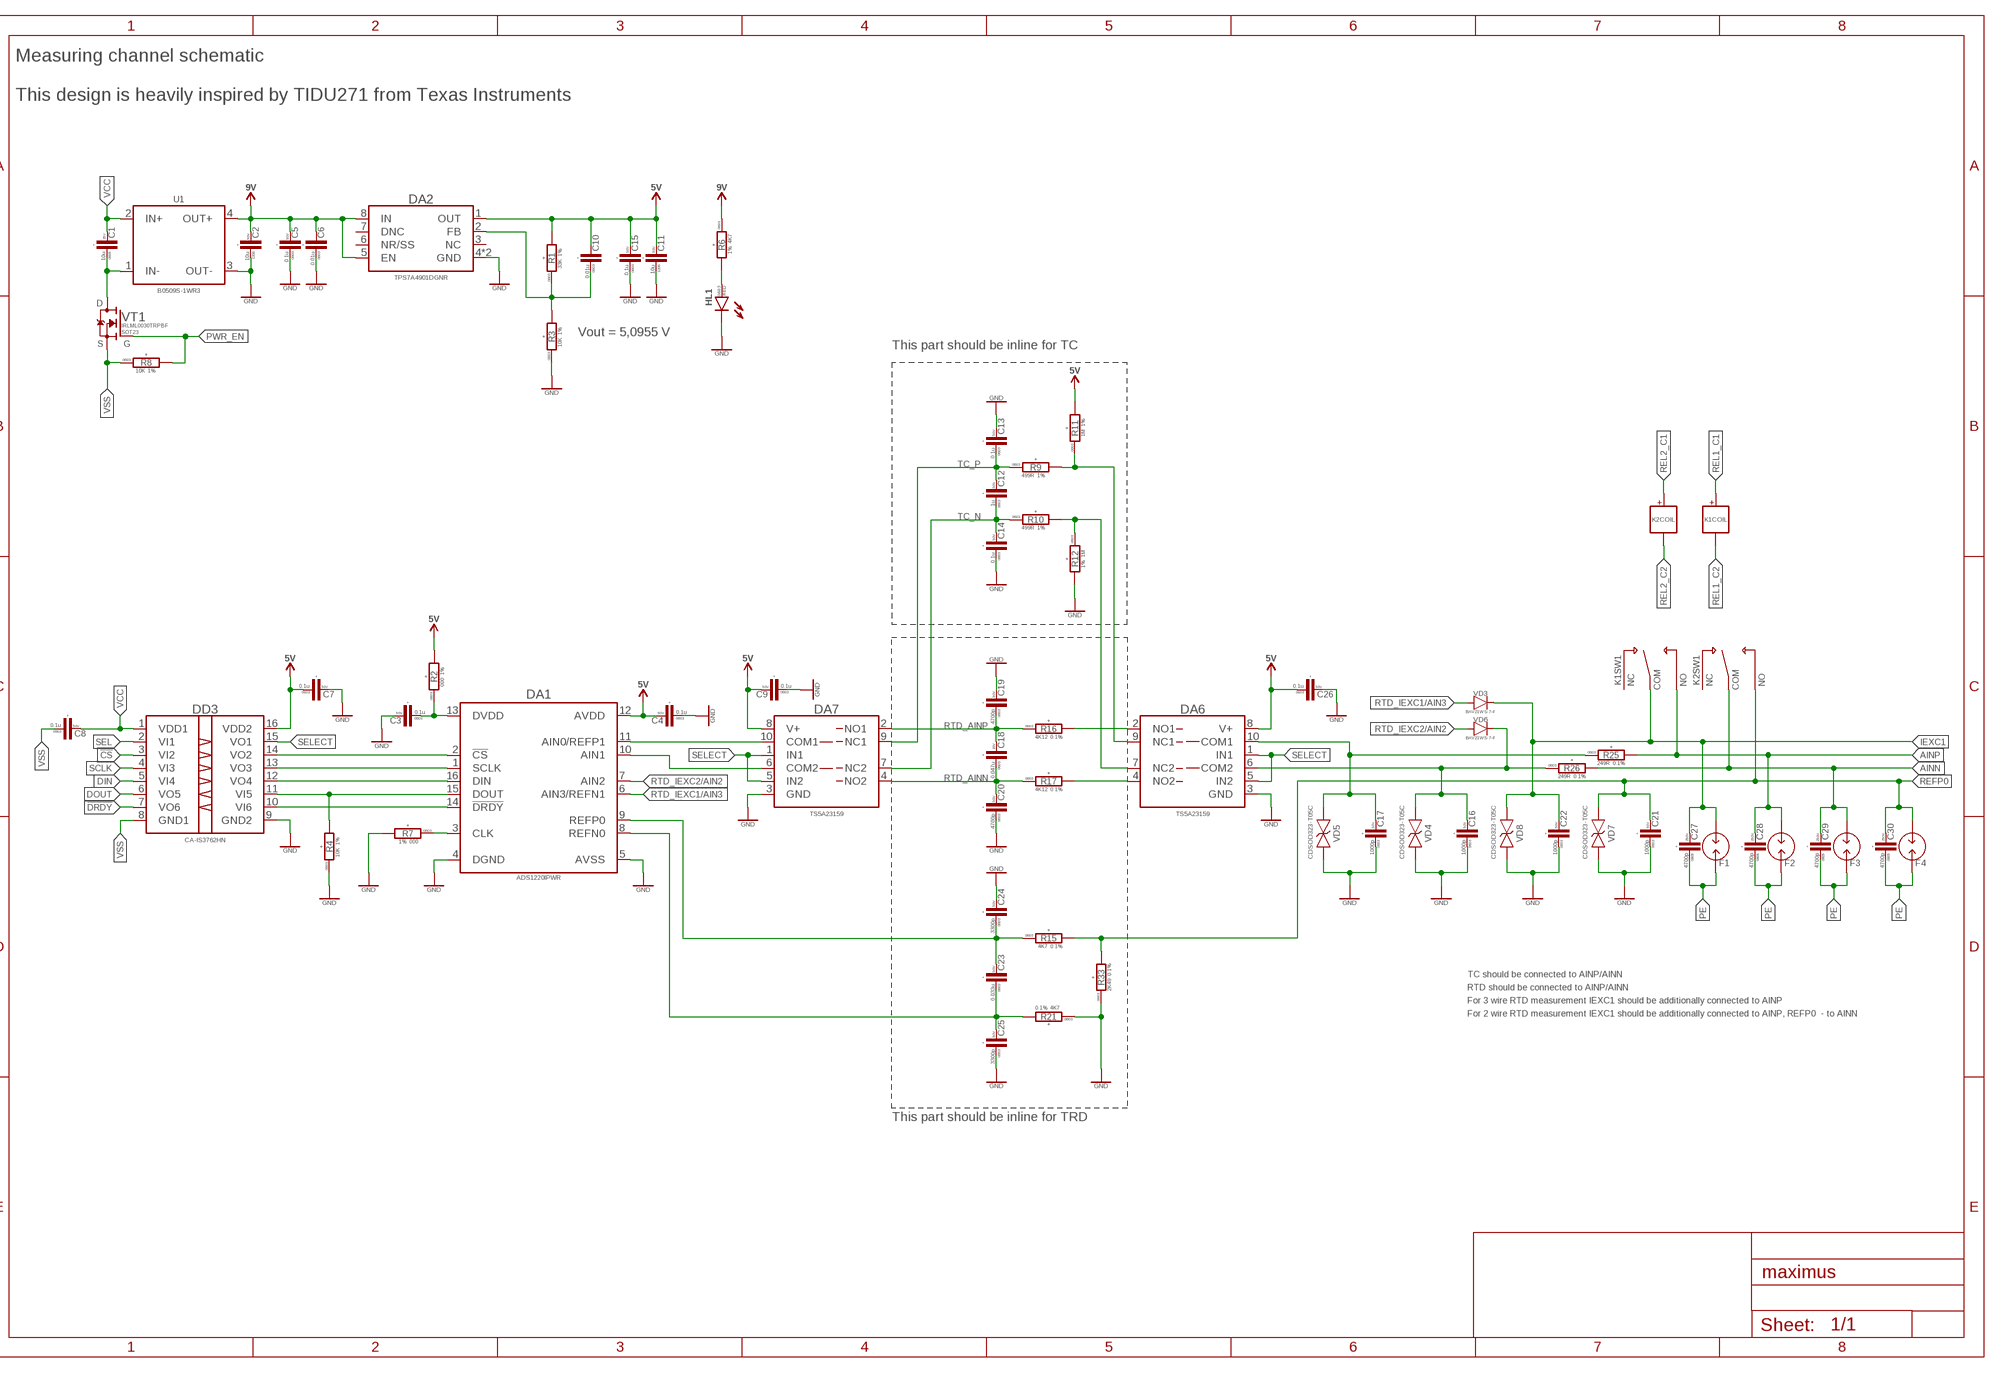
[diagram p6: schematic, module TMETER, sheet 1, part 2 of 2]

### Parts
C1  10u  C-0805  [C0805]
C2  10u  C-1206  [C1206]
C3  0.1u  C-0603  [C0603]
C4  0.1u  C-0603  [C0603]
C5  0.1u  C-0603  [C0603]
C6  0.01u  C-0603  [C0603]
C7  0.1u  C-0603  [C0603]
C8  0.1u  C-0603  [C0603]
C9  0.1u  C-0603  [C0603]
C10  0.01u  C-0603  [C0603]
C11  10u  C-1206  [C1206]
C12  1u  C-0603  [C0603]
C13  0.1u  C-0603  [C0603]
C14  0.1u  C-0603  [C0603]
C15  0.1u  C-0603  [C0603]
C16  1000p  C-0603  [C0603]
C17  1000p  C-0603  [C0603]
C18  0.047u  C-0603  [C0603]
C19  4700p  C-0603  [C0603]
C20  4700p  C-0603  [C0603]
C21  1000p  C-0603  [C0603]
C22  1000p  C-0603  [C0603]
C23  0.033u  C-0603  [C0603]
C24  3300p  C-0603  [C0603]
C25  3300p  C-0603  [C0603]
C26  0.1u  C-0603  [C0603]
C27  4700p  C-0805  [C0805]
C28  4700p  C-0805  [C0805]
C29  4700p  C-0805  [C0805]
C30  4700p  C-0805  [C0805]
DA1  ADS1220  [TSSOP16]
DA2  TPS7A49  [HVSSOP-8]
DA6  TS5A23159-VSSOP10  [VSSOP10]
DA7  TS5A23159-VSSOP10  [VSSOP10]
DD3  CA-IS3762  [SOIC16]
F1  SURGE_ARRESTER-S30-A90X  [S30-A90X]
F2  SURGE_ARRESTER-S30-A90X  [S30-A90X]
F3  SURGE_ARRESTER-S30-A90X  [S30-A90X]
F4  SURGE_ARRESTER-S30-A90X  [S30-A90X]
HL1  LED-0603  [LED0603]
K1  G6K-2F-Y  [G6K-2F]
K2  G6K-2F-Y  [G6K-2F]
R1  33K  R-1%-0603  [R0603]
R2  000  R-1%-0603  [R0603]
R3  10K  R-1%-0603  [R0603]
R4  10K  R-1%-0603  [R0603]
R6  4K7  R-1%-0603  [R0603]
R7  000  R-1%-0603  [R0603]
R8  10K  R-1%-0603  [R0603]
R9  499R  R-1%-0603  [R0603]
R10  499R  R-1%-0603  [R0603]
R11  1M  R-1%-0603  [R0603]
R12  1M  R-1%-0603  [R0603]
R15  4K7  R-1%-0603  [R0603]
R16  4K12  R-1%-0603  [R0603]
R17  4K12  R-1%-0603  [R0603]
R21  4K7  R-1%-0603  [R0603]
R25  249R  R-1%-0603  [R0603]
R26  249R  R-1%-0603  [R0603]
R33  2K49  R-1%-0603  [R0603]
U1  B0509S-1WR3  [SIP-4]
VD3  BAV21WS  [SOD323]
VD4  CDSOD323-T05C  [SOD323]
VD5  CDSOD323-T05C  [SOD323]
VD6  BAV21WS  [SOD323]
VD7  CDSOD323-T05C  [SOD323]
VD8  CDSOD323-T05C  [SOD323]
VT1  IRLML0030  [SOT23-3]

### Nets
!CS: DD3.3(VI2)
!DRDY: DD3.7(VO6)
AINN: C29.2 F3.1 K2.3(SW1:COM) R26.2
AINP: C28.2 F2.1 K1.4(SW1:NO) R25.2
DIN: DD3.5(VI4)
DOUT: DD3.6(VO5)
GND: C2.P$1 C3.2 C4.1 C5.1 C6.1 C7.2 C9.1 C11.P$1 C13.2 C14.1 C15.1 C16.1 C17.1 C19.2 C20.1 C21.1 C22.1 C24.2 C25.1 C26.2 DA1.4(DGND) DA1.5(AVSS) DA2.4(GND) DA2.EPAD(GND) DA6.3(GND) DA7.3(GND) DD3.9(GND2) HL1.C R3.1 R4.1 R7.2 R12.2 R21.1 R33.1 U1.3(OUT-) VD4.C VD5.C VD7.C VD8.C
IEXC1: C22.2 C27.2 F1.1 K1.3(SW1:COM) VD3.C VD8.A
N$1: DA1.3(CLK) R7.1
N$2: HL1.A R6.2
N$3: C10.1 DA2.2(FB) R1.1 R3.2
N$4: C3.1 DA1.13(DVDD) R2.1
N$5: DA1.2(!CS) DD3.14(VO2)
N$6: DA1.1(SCLK) DD3.13(VO3)
N$7: DA1.16(DIN) DD3.12(VO4)
N$8: DA1.15(DOUT) DD3.11(VI5) R4.2
N$9: DA1.14(!DRDY) DD3.10(VI6)
N$10: C1.1 U1.1(IN-) VT1.3(D)
N$23: DA6.2(NO1) R16.2
N$26: DA1.11(AIN0/REFP1) DA7.10(COM1)
N$28: DA1.10(AIN1) DA7.6(COM2)
N$29: DA6.4(NO2) R17.2
N$34: C17.2 DA6.10(COM1) R25.1 VD5.A
N$35: C16.2 DA6.6(COM2) R26.1 VD4.A VD6.C
N$36: DA6.9(NC1) R9.2 R11.1
N$37: DA6.7(NC2) R10.2 R12.1
PE: C27.1 C28.1 C29.1 C30.1 F1.2 F2.2 F3.2 F4.2
PWR_EN: R8.2 VT1.1(G)
REFP0: C21.2 C30.2 F4.1 K2.4(SW1:NO) R15.2 R33.2 VD7.A
REL1_C1: K1.1
REL1_C2: K1.8
REL2_C1: K2.1
REL2_C2: K2.8
RTD_AINN: C18.1 C20.2 DA7.4(NO2) R17.1
RTD_AINP: C18.2 C19.1 DA7.2(NO1) R16.1
RTD_IEXC1/AIN3: DA1.6(AIN3/REFN1) VD3.A
RTD_IEXC2/AIN2: DA1.7(AIN2) VD6.A
RTD_REFN0: C23.1 C25.2 DA1.8(REFN0) R21.2
RTD_REFP0: C23.2 C24.1 DA1.9(REFP0) R15.1
SCLK: DD3.4(VI3)
SEL: DD3.2(VI1)
SELECT: DA6.1(IN1) DA6.5(IN2) DA7.1(IN1) DA7.5(IN2) DD3.15(VO1)
TC_N: C12.1 C14.2 DA7.7(NC2) R10.1
TC_P: C12.2 C13.1 DA7.9(NC1) R9.1
VCC: C1.2 C8.2 DD3.1(VDD1) U1.2(IN+)
VDD_5V: C4.2 C7.1 C9.2 C10.2 C11.P$2 C15.2 C26.1 DA1.12(AVDD) DA2.1(OUT) DA6.8(V+) DA7.8(V+) DD3.16(VDD2) R1.2 R2.2 R11.2 ; supply symbol labelled 5V
VDD_9V: C2.P$2 C5.2 C6.2 DA2.5(EN) DA2.8(IN) R6.1 U1.4(OUT+) ; supply symbol labelled 9V
VSS: C8.1 DD3.8(GND1) R8.1 VT1.2(S)
Unconnected: DA2.3(NC) DA2.6(NR/SS) DA2.7(DNC) K1.2(SW1:NC) K1.5(SW2:NO) K1.6(SW2:COM) K1.7(SW2:NC) K2.2(SW1:NC) K2.5(SW2:NO) K2.6(SW2:COM) K2.7(SW2:NC)

### Notes on the sheet
- Measuring channel schematic
- This design is heavily inspired by TIDU271 from Texas Instruments
- Vout = 5,0955 V
- This part should be inline for TC
- TC should be connected to AINP/AINN
- RTD should be connected to AINP/AINN
- For 3 wire RTD measurement IEXC1 should be additionally connected to AINP
- For 2 wire RTD measurement IEXC1 should be additionally connected to AINP, REFP0  - to AINN
- This part should be inline for TRD

### Library data of the parts
C1 = rc:C; ALLOCATED: +; LCSC#: C89831; MANF: YAGEO; MANF#: CC0805KKX5R8BB106; PACKAGE: 0805; RU: Конденсатор керамический SMD 0805; VOLTAGE: 25V
C2 C11 = rc:C; ALLOCATED: +; LCSC#: C100122; MANF: YAGEO; MANF#: CC1206KKX5R9BB106; PACKAGE: 1206; RU: Конденсатор керамический SMD 1206; VOLTAGE: 50V
C3-C5 C7-C9 C13-C15 C26 = rc:C; ALLOCATED: +; LCSC#: C91183; MANF: YAGEO; MANF#: CC0603JRX7R9BB104; PACKAGE: 0603; RU: Конденсатор керамический SMD 0603; VOLTAGE: 50V
C6 C10 = rc:C; ALLOCATED: +; LCSC#: C115056; MANF: YAGEO; MANF#: CC0603JRX7R9BB103; PACKAGE: 0603; RU: Конденсатор керамический SMD 0603
C12 = rc:C; ALLOCATED: +; LCSC#: C559769; MANF: YAGEO; MANF#: CC0603KRX7R9BB105; PACKAGE: 0603; RU: Конденсатор керамический SMD 0603; VOLTAGE: 50V
C16 C17 C21 C22 = rc:C; ALLOCATED: +; LCSC#: C131031; MANF: YAGEO; MANF#: CC0603JRX7R9BB102; PACKAGE: 0603; RU: Конденсатор керамический SMD 0603; VOLTAGE: 50V
C18 = rc:C; ALLOCATED: +; LCSC#: C115058; MANF: YAGEO; MANF#: CC0603KRX7R7BB473; PACKAGE: 0603; RU: Конденсатор керамический SMD 0603; VOLTAGE: 16V
C19 C20 = rc:C; ALLOCATED: +; LCSC#: C106218; MANF: YAGEO; MANF#: CC0603KRX7R9BB472; PACKAGE: 0603; RU: Конденсатор керамический SMD 0603; VOLTAGE: 50V
C23 = rc:C; ALLOCATED: +; LCSC#: C106856; MANF: YAGEO; MANF#: CC0603KRX7R9BB333; PACKAGE: 0603; RU: Конденсатор керамический SMD 0603; VOLTAGE: 50V
C24 C25 = rc:C; ALLOCATED: +; LCSC#: C107088; MANF: YAGEO; MANF#: CC0603KRX7R9BB332; PACKAGE: 0603; RU: Конденсатор керамический SMD 0603; VOLTAGE: 50V
C27-C30 = rc:C; ALLOCATED: +; LCSC#: C415395; MANF: muRata; MANF#: GRM21AR72E472KW01D; PACKAGE: 0805; RU: Конденсатор керамический SMD 0805; VOLTAGE: 250V
DA1 = misc:ADS1220: ADS1220 4-Channel, 2-kSPS, Low-Power, 24-Bit ADC with Integrated PGA and Reference; LCSC#: C48263; MANF: Texas Instruments; MANF#: ADS1220IPWR; RU: Микросхема
DA2 = linear regulators:TPS7A49: 36-V, 150-mA, Ultralow-Noise, Positive Linear Regulator; LCSC#: C16430; MANF: TI; MANF#: TPS7A4901DGNR; RU: Малошумящий регулируемый LDO-стабилизатор напряжения, 150 мА, 36 В
DA6 DA7 = misc:TS5A23159: 2 1.1Ω 1.65V~5.5V VSSOP-10-0.5mm Analog Switches, Multiplexers, Demultiplexers RoHS; LCSC#: C42751; MANF: TI; MANF#: TS5A23159; RU: Микросхема
DD3 = misc:CA-IS3762: Digital Isolator 3750Vrms Forward 4 Channel Reverse 2 Channel 150Mbps 100kV/us CMTI SOIC-16; LCSC#: C428893; MANF: Chipanalog; MANF#: CA-IS3762HN; RU: Микросхема
F1-F4 = rc:SURGE_ARRESTER: S30-A90X Surge arrester; LCSC#: C3660985; MANF: TDK; MANF#: B88069X9231T253; RU: Газоразрядник S30-A90X (90V, 2kA, 2 вывода, SMD1812)
HL1 = rc:LED: Light emitting diode; COLOR: RED; LCSC#: C5158814; MANF: Ningbo Foryard Optoelectronics; MANF#: FYLS-0603URC; PACKAGE: 0603; RU: Светодиод SMD 0603
K1 K2 = misc:G6K-2F-Y: Surface Mounting Relay with the World’s Smallest Mounting Area Datasheet <https://omronfs.omron.com/en_US/ecb/products/pdf/en-g6k.pdf>; LCSC#: C47190; MANF: OMRON; MANF#: G6K-2F-Y-TR DC5; RU: Реле для поверхностного монтажа
R1 = rc:R; ALLOCATED: +; LCSC#: C126359; MANF: YAGEO; MANF#: RC0603FR-0733KL; PACKAGE: 0603; RU: Резистор SMD 0603; TOLERANCE: 1%
R2 R7 = rc:R; ALLOCATED: +; LCSC#: C95177; MANF: YAGEO; MANF#: RC0603JR-070RL; PACKAGE: 0603; RU: Резистор SMD 0603; TOLERANCE: 1%
R3 R4 R8 = rc:R; ALLOCATED: +; LCSC#: C98220; MANF: YAGEO; MANF#: RC0603FR-0710KL; PACKAGE: 0603; RU: Резистор SMD 0603; TOLERANCE: 1%
R6 = rc:R; ALLOCATED: +; LCSC#: C99782; MANF: YAGEO; MANF#: RC0603FR-074K7L; PACKAGE: 0603; RU: Резистор SMD 0603; TOLERANCE: 1%
R9 R10 = rc:R; ALLOCATED: +; LCSC#: C144655; MANF: YAGEO; MANF#: AC0603FR-07499RL; PACKAGE: 0603; RU: Резистор SMD 0603; TOLERANCE: 1%
R11 R12 = rc:R; ALLOCATED: +; LCSC#: C105578; MANF: YAGEO; MANF#: RC0603FR-071ML; PACKAGE: 0603; RU: Резистор SMD 0603; TOLERANCE: 1%
R15 R21 = rc:R; ALLOCATED: +; LCSC#: C513565; MANF: YAGEO; MANF#: RT0603BRD074K7L; PACKAGE: 0603; RU: Резистор SMD 0603; TOLERANCE: 0.1%
R16 R17 = rc:R; ALLOCATED: +; LCSC#: C861436; MANF: YAGEO; MANF#: RT0603BRD074K12L; PACKAGE: 0603; RU: Резистор SMD 0603; TOLERANCE: 0.1%
R25 = rc:R; ALLOCATED: +; LCSC#: C861249; MANF: YAGEO; MANF#: RT0603BRD07249RL; PACKAGE: 0603; RU: Резистор SMD 0603; TOLERANCE: 0.1%
R26 = rc:R; ALLOCATED: +; LCSC#: C22548; MANF: YAGEO; MANF#: RC0603FR-071KL; PACKAGE: 0603; RU: Резистор SMD 0603; TOLERANCE: 0.1%
R33 = rc:R; ALLOCATED: +; LCSC#: C860301; MANF: YAGEO; MANF#: RT0603BRB072K49L; PACKAGE: 0603; RU: Резистор SMD 0603; TOLERANCE: 0.1%
U1 = dc-dc:B0509S-1WR3: 1W, Fixed input voltage, isolated & unregulated single output dc-dc converter; LCSC#: C5369463; MANF: Mornsun Power; MANF#: B0509S-1WR3; RU: Изолированный DC-DC преобразователь мощностью 1 Вт
VD3 VD6 = Diodes:BAV21WS: Diode Independent 200V 200mA Surface Mount SOD-323; LCSC#: C151350; MANF: DIODES BAV21WS-7-F; MANF#: BAV21WS-7-F; RU: Диод одиночный, 200 В, 200 мА, поверхностный монтаж
VD4 VD5 VD7 VD8 = TVS_diodes:CDSOD323-T05C: TVS Diode Array Series Datasheet <https://static.chipdip.ru/lib/618/DOC014618321.pdf>; LCSC#: C711706; MANF: Bourns; MANF#: CDSOD323-T05C; RU: Сборка TVS-диодов
VT1 = mosfet:IRLML0030: MOSFET N-CH 30V 5.3A SOT-23-3; DIGIKEY#: IRLML0030TRPBFTR-ND; LCSC#: C3647050; MANF: Infineon Technologies; MANF#: IRLML0030TRPBF; PACKAGE: SOT23; RU: Полевой транзистор

## Net classes
1 HV: width 0.2 mm, drill 0.3 mm, clearance 0.25 mm to class 0, clearance 0.25 mm